# Altium project PCU.PrjPCB (part 2 of 2)

## Sheet pcuOut.SchDoc
size A3
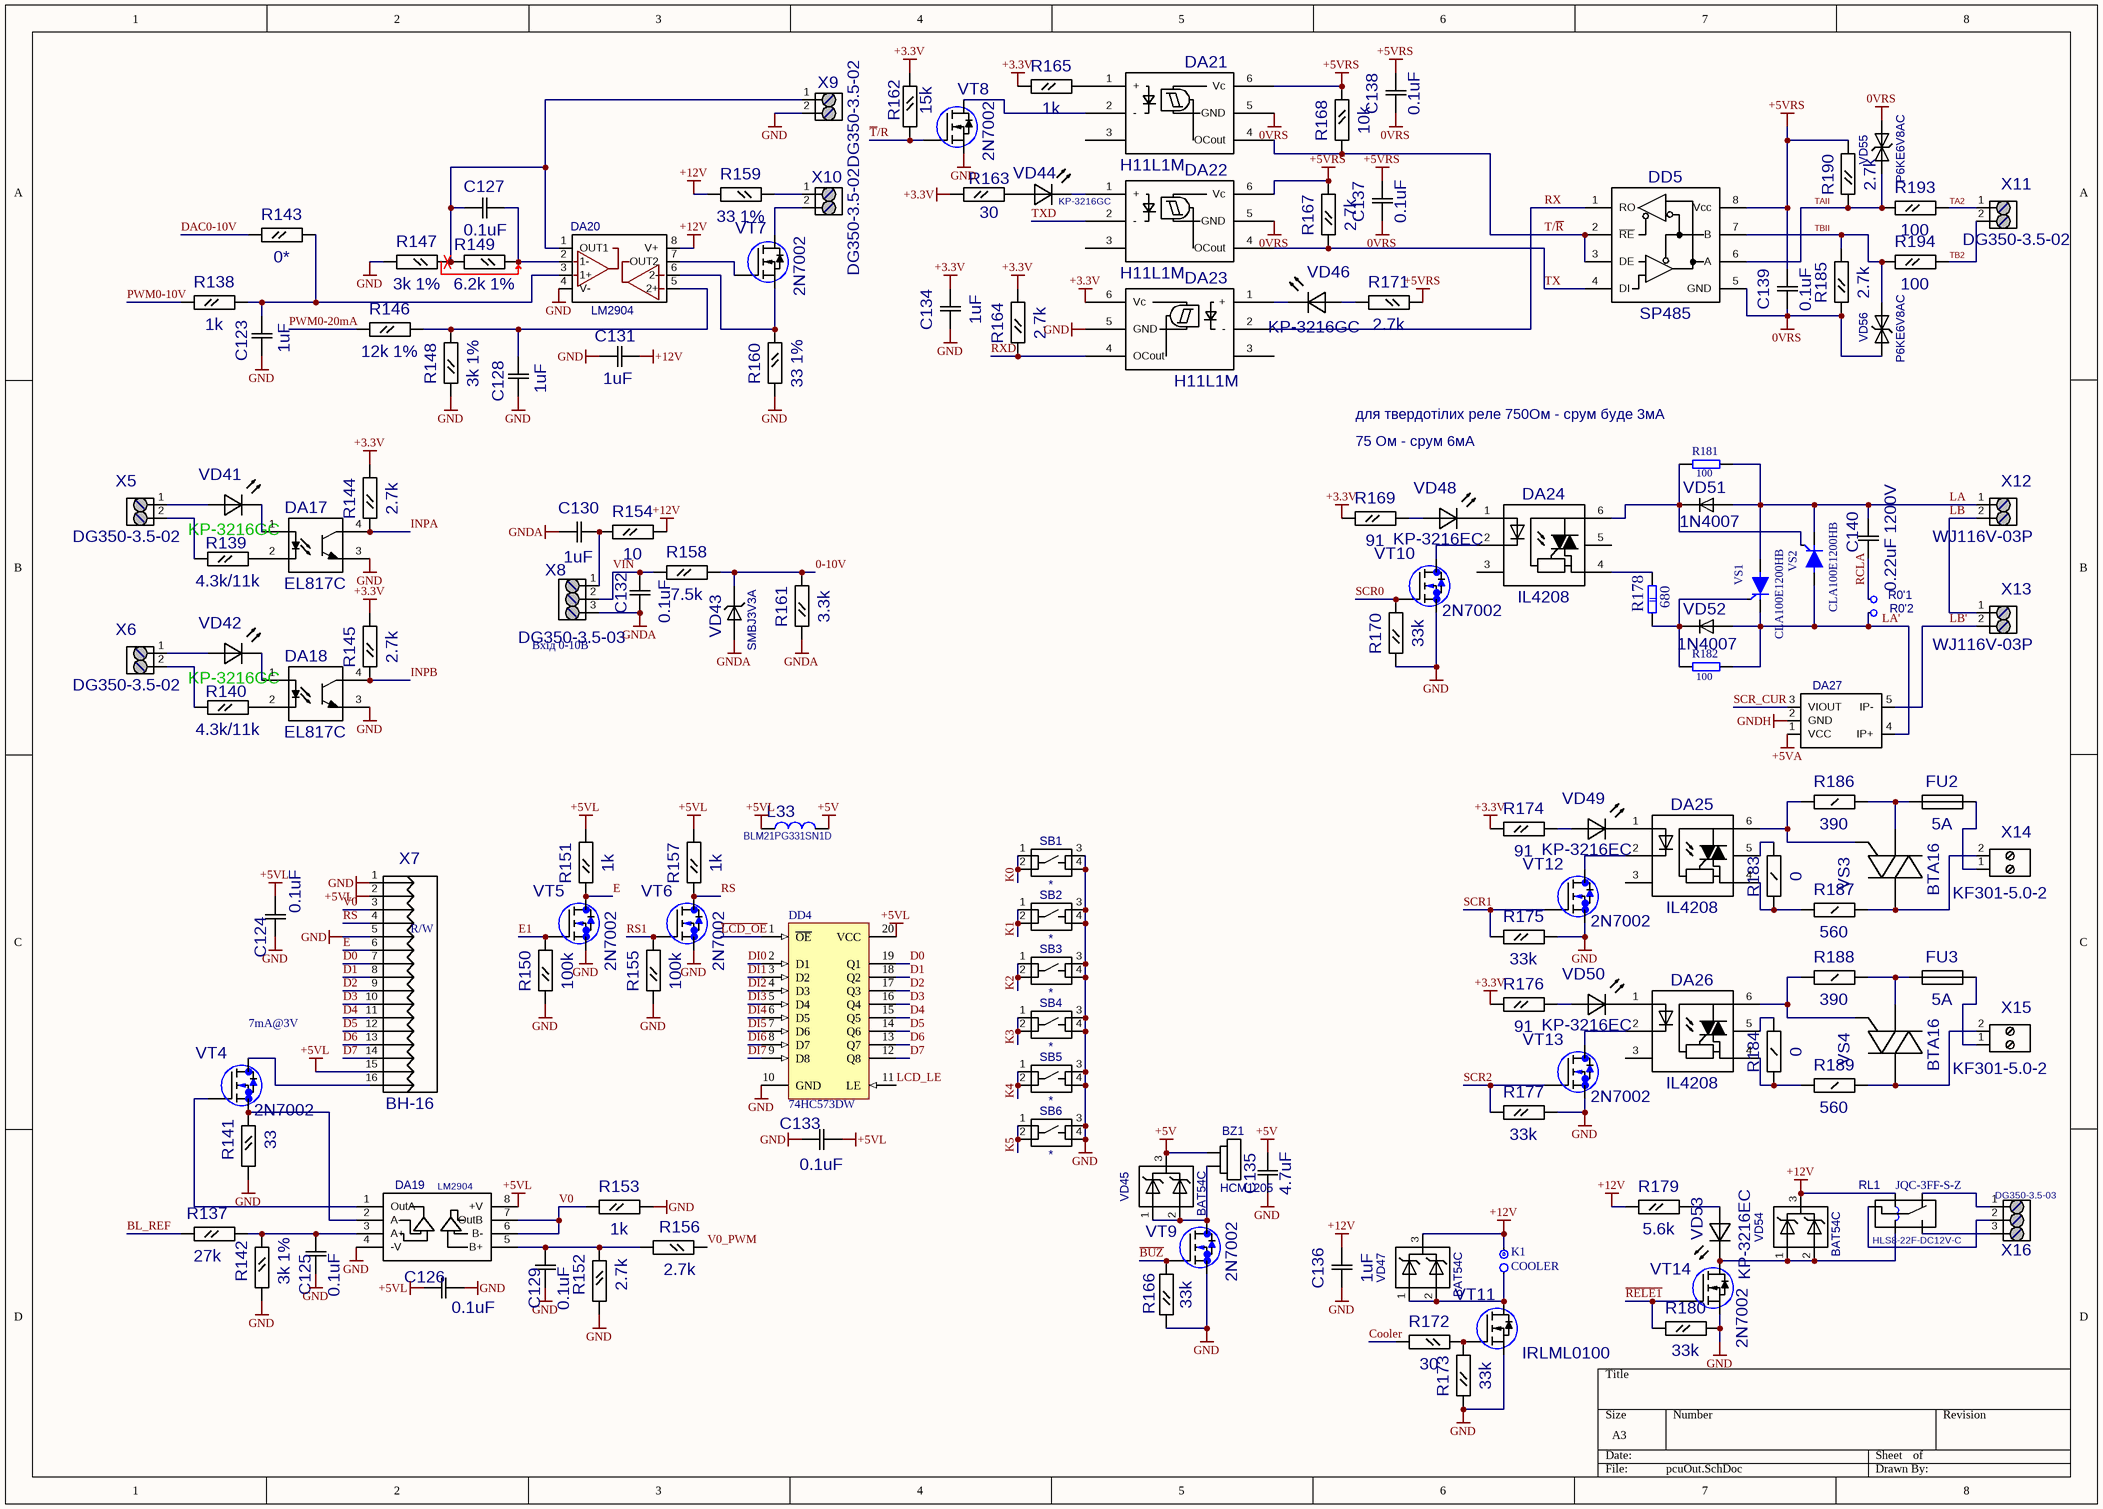
[diagram p4: pcuOut.SchDoc]

### Parts
BZ1  HCM1205  [D12_P7-62]
C123  value 1uF  [C0805]  (hidden comment: C0805)
C124  value 0.1uF  [C0805]  (hidden comment: C0805)
C125  value 0.1uF  [C0805]  (hidden comment: C0805)
C126  value 0.1uF  [C0805]  (hidden comment: C0805)
C127  value 0.1uF  [C0805]  (hidden comment: C0805)
C128  value 1uF  [C0805]  (hidden comment: C0805)
C129  value 0.1uF  [C0805]  (hidden comment: C0805)
C130  value 1uF  [C0805]  (hidden comment: C0805)
C131  value 1uF  [C0805]  (hidden comment: C0805)
C132  value 0.1uF  [C0805]  (hidden comment: C0805)
C133  value 0.1uF  [C0805]  (hidden comment: C0805)
C134  value 1uF  [C0805]  (hidden comment: C0805)
C135  value 4.7uF  [C1206]  (hidden comment: C1206)
C136  value 1uF  [C0805]  (hidden comment: C0805)
C137  value 0.1uF  [C0805]  (hidden comment: C0805)
C138  value 0.1uF  [C0805]  (hidden comment: C0805)
C139  value 0.1uF  [C0805]  (hidden comment: C0805)
C140  0.22uF 1200V  [CBB21]
DA17  EL817C  [DIL4SMD]
DA18  EL817C  [DIL4SMD]
DA19  value LM2904  [SO8-150]  (hidden comment: LM358D)
DA20  LM2904  [SO8-1.27]
DA21  H11L1M  [DIP6_SURFACE]
DA22  H11L1M  [DIP6_SURFACE]
DA23  H11L1M  [DIP6_SURFACE]
DA24  IL4208  [DIP6]
DA25  IL4208  [DIP6]
DA26  IL4208  [DIP6]
DA27  ACS758  [CB]  (value not drawn)
DD4  74HC573DW  [DW020_N]
DD5  SP485  [SO8-150]
FU2  value 5A  [FU_5x20]  (hidden comment: FUSE-D5)
FU3  value 5A  [FU_5x20]  (hidden comment: FUSE-D5)
K1  COOLER  [J1x2]
L33  BLM21PG331SN1D  [R0805]
R0'1  1mm  [PCB_hole_1mm]  (value not drawn)
R0'2  1mm  [PCB_hole_1mm]  (value not drawn)
R137  value 27k  [R0805]  (hidden comment: R0805)
R138  value 1k  [R0805]  (hidden comment: R0805)
R139  value 4.3k/11k  [R0805]  (hidden comment: R0805)
R140  value 4.3k/11k  [R0805]  (hidden comment: R0805)
R141  value 33  [R0805]  (hidden comment: R0805)
R142  value 3k 1%  [R0805]  (hidden comment: R0805)
R143  value 0*  [R0805]  (hidden comment: R0805)
R144  value 2.7k  [R0805]  (hidden comment: R0805)
R145  value 2.7k  [R0805]  (hidden comment: R0805)
R146  value 12k 1%  [R0805]  (hidden comment: R0805)
R147  value 3k 1%  [R0805]  (hidden comment: R0805)
R148  value 3k 1%  [R0805]  (hidden comment: R0805)
R149  value 6.2k 1%  [R0805]  (hidden comment: R0805)
R150  value 100k  [R0805]  (hidden comment: R0805)
R151  value 1k  [R0805]  (hidden comment: R0805)
R152  value 2.7k  [R0805]  (hidden comment: R0805)
R153  value 1k  [R0805]  (hidden comment: R0805)
R154  value 10  [R0805]  (hidden comment: R0805)
R155  value 100k  [R0805]  (hidden comment: R0805)
R156  value 2.7k  [R0805]  (hidden comment: R0805)
R157  value 1k  [R0805]  (hidden comment: R0805)
R158  value 7.5k  [R0805]  (hidden comment: R0805)
R159  value 33 1%  [R0805]  (hidden comment: R0805)
R160  value 33 1%  [R0805]  (hidden comment: R0805)
R161  value 3.3k  [R0805]  (hidden comment: R0805)
R162  value 15k  [R0805]  (hidden comment: R0805)
R163  value 30  [R0805]  (hidden comment: R0805)
R164  value 2.7k  [R0805]  (hidden comment: R0805)
R165  value 1k  [R0805]  (hidden comment: R0805)
R166  value 33k  [R0805]  (hidden comment: R0805)
R167  value 2.7k  [R0805]  (hidden comment: R0805)
R168  value 10k  [R0805]  (hidden comment: R0805)
R169  value 91  [R0805]  (hidden comment: R0805)
R170  value 33k  [R0805]  (hidden comment: R0805)
R171  value 2.7k  [R0805]  (hidden comment: R0805)
R172  value 30  [R0805]  (hidden comment: R0805)
R173  value 33k  [R0805]  (hidden comment: R0805)
R174  value 91  [R0805]  (hidden comment: R0805)
R175  value 33k  [R0805]  (hidden comment: R0805)
R176  value 91  [R0805]  (hidden comment: R0805)
R177  value 33k  [R0805]  (hidden comment: R0805)
R178  680  [R2W CF-700]
R179  value 5.6k  [R0805]  (hidden comment: R0805)
R180  value 33k  [R0805]  (hidden comment: R0805)
R181  100  [R0.5-400]
R182  100  [R0.5-400]
R183  value 0  [R1206]  (hidden comment: R1206)
R184  value 0  [R1206]  (hidden comment: R1206)
R185  value 2.7k  [R0805]  (hidden comment: R0805)
R186  value 390  [R1206]  (hidden comment: R1206)
R187  value 560  [R1206]  (hidden comment: R1206)
R188  value 390  [R1206]  (hidden comment: R1206)
R189  value 560  [R1206]  (hidden comment: R1206)
R190  value 2.7k  [R0805]  (hidden comment: R0805)
R193  value 100  [R0805]  (hidden comment: R0805)
R194  value 100  [R0805]  (hidden comment: R0805)
RL1  value HLS8-22F-DC12V-C  [RELAY833]  (hidden comment: RELEY833)
SB1  *  [DTSM-6]
SB2  *  [DTSM-6]
SB3  *  [DTSM-6]
SB4  *  [DTSM-6]
SB5  *  [DTSM-6]
SB6  *  [DTSM-6]
VD41  KP-3216GC  [KP-3216 Hole]
VD42  KP-3216GC  [KP-3216 Hole]
VD43  value SMBJ3V3A  [DO-214AA(SMB)]  (hidden comment: 10BQ100)
VD44  KP-3216GC  [KP-3216]
VD45  BAT54C  [SOT23-1]
VD46  KP-3216GC  [KP-3216]
VD47  BAT54C  [SOT23-1]
VD48  KP-3216EC  [KP-3216]
VD49  KP-3216EC  [KP-3216]
VD50  KP-3216EC  [KP-3216]
VD51  value 1N4007  [DIOD_Wsmall_bigholes]  (hidden comment: DIOD)
VD52  value 1N4007  [DIOD_Wsmall_bigholes]  (hidden comment: DIOD)
VD53  KP-3216EC  [KP-3216 Hole]
VD54  BAT54C  [SOT23-1]
VD55  value P6KE6V8AC  [DIOD_small_bigholes]  (hidden comment: P6KE___C)
VD56  value P6KE6V8AC  [DIOD_small_bigholes]  (hidden comment: P6KE___C)
VS1  CLA100E1200HB  [TO247-RA-800a]
VS2  CLA100E1200HB  [TO247-RA-800a]
VS3  value BTA16  [TO220-RB-600]  (hidden comment: TRIAC)
VS4  value BTA16  [TO220-RB-600]  (hidden comment: TRIAC)
VT4  2N7002  [SOT23-1]
VT5  2N7002  [SOT23-1]
VT6  2N7002  [SOT23-1]
VT7  2N7002  [SOT23-1]
VT8  2N7002  [SOT23-1]
VT9  2N7002  [SOT23-1]
VT10  2N7002  [SOT23-1]
VT11  IRLML0100  [SOT23-1]
VT12  2N7002  [SOT23-1]
VT13  2N7002  [SOT23-1]
VT14  2N7002  [SOT23-1]
X5  DG350-3.5-02  [DG350-3.5-02 SLIM]
X6  DG350-3.5-02  [DG350-3.5-02 SLIM]
X7  BH-16  [BH-16]
X8  DG350-3.5-03  [DG350-3.5-03]
X9  DG350-3.5-02  [DG350-3.5-02]
X10  DG350-3.5-02  [DG350-3.5-02]
X11  DG350-3.5-02  [DG350-3.5-02 SLIM]
X12  WJ116V-03P  [WJ116V]
X13  WJ116V-03P  [WJ116V]
X14  KF301-5.0-2  [KF301-5.0-2]
X15  KF301-5.0-2  [KF301-5.0-2]
X16  DG350-3.5-03  [DG350-3.5-03 slim]

### Nets
0VRS: C137.1 C138.1 C139.1 DA21.5(GND) DA22.5(GND) DD5.5(GND) R185.2 VD55.2 VD56.2
+3.3V: C134.2 DA23.6(Vc) R144.1 R145.1 R162.2 R163.2 R164.1 R165.2 R169.2 R174.2 R176.2
+5V: BZ1.1 C135.2 L33.2 VD45.3
+5VA: DA27.1(VCC)
+5VL: C124.1 C126.2 C133.1 DA19.8(+V) DD4.20(VCC) L33.1 R151.1 R157.1 X7.2 X7.15
+5VRS: C137.2 C138.2 C139.2 DA21.6(Vc) DA22.6(Vc) DD5.8(Vcc) R167.1 R168.2 R171.2 R190.1
+12V: C131.2 C136.2 DA20.8(V+) K1.1 R154.1 R159.1 R179.2 RL1.5 VD47.3 VD54.3
GND: C123.1 C124.2 C125.1 C126.1 C128.1 C129.1 C131.1 C133.2 C134.1 C135.1 C136.1 DA17.3(E) DA18.3(E) DA19.4(-V) DA20.4(V-) DA23.5(GND) DD4.10(GND) R141.1 R142.1 R147.1 R148.2 R150.2 R152.1 R153.1 R155.2 R160.1 R166.2 R170.2 R173.2 R175.1 R177.1 R180.1 SB1.3 SB1.4 SB2.3 SB2.4 SB3.3 SB3.4 SB4.3 SB4.4 SB5.3 SB5.4 SB6.3 SB6.4 VT5.2(S) VT6.2(S) VT8.2(S) VT9.2(S) VT10.2(S) VT11.2(S) VT12.2(S) VT13.2(S) VT14.2(S) X7.1 X7.5 X9.2
GNDA: C130.1 C132.2 R161.2 VD43.2 X8.3
GNDH: DA27.2(GND)
0-10V: R158.1 R161.1 VD43.1
~{BUZ}: R166.1 VT9.1(G)
~{LCD_OE}: DD4.1(~{OE})
~{RELE1}: R180.2 VT14.1(G)
BL_REF: R137.2
Cooler: R172.1
D0: DD4.19(Q1) X7.7
D1: DD4.18(Q2) X7.8
D2: DD4.17(Q3) X7.9
D3: DD4.16(Q4) X7.10
D4: DD4.15(Q5) X7.11
D5: DD4.14(Q6) X7.12
D6: DD4.13(Q7) X7.13
D7: DD4.12(Q8) X7.14
DAC0-10V: R143.2
DI0: DD4.2(D1)
DI1: DD4.3(D2)
DI2: DD4.4(D3)
DI3: DD4.5(D4)
DI4: DD4.6(D5)
DI5: DD4.7(D6)
DI6: DD4.8(D7)
DI7: DD4.9(D8)
E: R151.2 VT5.3(D) X7.6
E1: R150.1 VT5.1(G)
INPA: DA17.4(C) R144.2
INPB: DA18.4(C) R145.2
K0: SB1.1 SB1.2
K1: SB2.1 SB2.2
K2: SB3.1 SB3.2
K3: SB4.1 SB4.2
K4: SB5.1 SB5.2
K5: SB6.1 SB6.2
LA: C140.2 R181.2 VD51.2(+) VS1.2(A) VS2.1(C) X12.1
LA': DA27.4(IP+) R0'2.?1 R182.2 VD52.2(+) VS1.1(C) VS2.2(A)
LB: X12.2 X13.1
LB': DA27.5(IP-) X13.2
LCD_LE: DD4.11(LE)
PWM0-10V: R138.2
PWM0-20mA: R146.2
RCLA: C140.1 R0'1.?1
RS: R157.2 VT6.3(D) X7.4
RS1: R155.1 VT6.1(G)
RX: DA23.2(-) DD5.1(RO)
RXD: DA23.4(OCout) R164.2
SCR0: R170.1 VT10.1(G)
SCR1: R175.2 VT12.1(G)
SCR2: R177.2 VT13.1(G)
SCR_CUR: DA27.3(VIOUT)
T/~{R}: DA21.4(OCout) DD5.2(~{RE}) DD5.3(DE) R168.1
~{T}/R: R162.1 VT8.1(G)
TA2: R193.1 X11.1
TAII: DD5.6(A) R190.2 R193.2 VD55.1
TB2: R194.1 X11.2
TBII: DD5.7(B) R185.1 R194.2 VD56.1
TX: DA22.4(OCout) DD5.4(DI) R167.2
TXD: DA22.2(-)
V0: DA19.6(B-) DA19.7(OutB) R153.2 X7.3
V0_PWM: R156.2
VIN: C132.1 R158.2 X8.2
NetBZ1_2: BZ1.2 VD45.1 VD45.2 VT9.3(D)
NetC123_2: C123.2 DA20.3(1+) R138.1 R143.1
NetC125_2: C125.2 DA19.3(A+) R137.1 R142.2
NetC127_1: C127.1 DA20.1(OUT1) R147.2 R149.1 X9.1
NetC127_2: C127.2 DA20.2(1-) R149.2
NetC128_2: C128.2 DA20.5(2+) R146.1 R148.1
NetC129_2: C129.2 DA19.5(B+) R152.2 R156.1
NetC130_2: C130.2 R154.2 X8.1
NetDA17_1: DA17.1(+) VD41.2
NetDA17_2: DA17.2(-) R139.1
NetDA18_1: DA18.1(+) VD42.2
NetDA18_2: DA18.2(-) R140.1
NetDA19_1: DA19.1(OutA) VT4.1(G)
NetDA19_2: DA19.2(A-) R141.2 VT4.2(S)
NetDA20_6: DA20.6(2-) R160.2 VT7.2(S)
NetDA20_7: DA20.7(OUT2) VT7.1(G)
NetDA21_1: DA21.1(+) R165.1
NetDA21_2: DA21.2(-) VT8.3(D)
NetDA22_1: DA22.1(+) VD44.2
NetDA23_1: DA23.1(+) VD46.2
NetDA24_1: DA24.1 VD48.2
NetDA24_2: DA24.2 VT10.3(D)
NetDA24_4: DA24.4 R178.2
NetDA24_6: DA24.6 R181.1 VD51.1(-) VS2.3(G)
NetDA25_1: DA25.1 VD49.2
NetDA25_2: DA25.2 VT12.3(D)
NetDA25_4: DA25.4 R183.2 R187.2
NetDA25_5: DA25.5 R183.1
NetDA25_6: DA25.6 R186.2 VS3.3(G)
NetDA26_1: DA26.1 VD50.2
NetDA26_2: DA26.2 VT13.3(D)
NetDA26_4: DA26.4 R184.2 R189.2
NetDA26_5: DA26.5 R184.1
NetDA26_6: DA26.6 R188.2 VS4.3(G)
NetFU2_1: FU2.1 R186.1 VS3.1(A1)
NetFU2_2: FU2.2 X14.1
NetFU3_1: FU3.1 R188.1 VS4.1(A1)
NetFU3_2: FU3.2 X15.1
NetK1_2: K1.2 VD47.1 VD47.2 VT11.3(D)
NetR139_2: R139.2 X5.2
NetR140_2: R140.2 X6.2
NetR159_2: R159.2 X10.1
NetR163_1: R163.1 VD44.1
NetR169_1: R169.1 VD48.1
NetR171_1: R171.1 VD46.1
NetR172_2: R172.2 R173.1 VT11.1(G)
NetR174_1: R174.1 VD49.1
NetR176_1: R176.1 VD50.1
NetR178_1: R178.1 R182.1 VD52.1(-) VS1.3(G)
NetR179_1: R179.1 VD53.1
NetR187_1: R187.1 VS3.2(A2) X14.2
NetR189_1: R189.1 VS4.2(A2) X15.2
NetRL1_1: RL1.1 X16.2
NetRL1_2: RL1.2 X16.3
NetRL1_3: RL1.3 X16.1
NetRL1_4: RL1.4 VD53.2 VD54.1 VD54.2 VT14.3(D)
NetVD41_1: VD41.1 X5.1
NetVD42_1: VD42.1 X6.1
NetVT4_3: VT4.3(D) X7.16
NetVT7_3: VT7.3(D) X10.2

Not connected (* = marked no-connect by the designer): DA21 3; DA22 3; DA23 3; DA24 3 5; DA25 3; DA26 3

### Notes on the sheet
- 75 Ом - срум 6мА
- (near R181) для твердотілих реле 750Ом - срум буде 3мА
- (near X8) Вхід 0-10В
- (near X7) R/W
- (near VT4) 7mA@3V
- (near RL1) JQC-3FF-S-Z

### Library data of the parts
C123-C134 C136-C139 = C0805: RefDes2: {RefDes2}
C135 = C1206: RefDes2: {RefDes2}
C140 = Cap: CBB21; RefDes2: {RefDes2}
DA17 DA18 = PC817: optocuple; Value: EL817C
DA20 = LM2904: LM2903; Value: *
DA21-DA23 = H11L1M: RefDes2: {RefDes2}
DA24-DA26 = IL410: RefDes2: {RefDes2}; Value: IL4208
DD4 = 74HC573DW: Octal D-Type Transparent Latch with 3-State Outputs; Published: 8-Jun-2000; LatestRevisionDate: 13-Apr-2006; LatestRevisionNote: IPC-7351 Footprint Added.; DatasheetVersion: Jun-1989; PackageVersion: Mar-2000; PackageReference: DW020; Publisher: Altium Limited; PackageDescription: 20-Pin Plastic Small Outline Integrated Circuit 1.27 mm Pitch; Code_JEDEC: MS-013; Code_IPC: SOIC127P1030-20; ComponentLink1Description: Manufacturer Link; ComponentLink1URL: http://www.ti.com/
DD5 = SP485: RS485; RefDes2: {RefDes2}; Value: SP485
FU2 FU3 = FUSE-D5: Fuse
K1 = H-1x2
L33 = BLM21PG331SN1D: Ferrite beads; Value: BLM21PG331SN1D
R0'1 R0'2 = PCB_1H: PCB_1R
R137-R177 R179 R180 R185 R190 R193 R194 = R0805: RefDes2: {RefDes2}
R178 = R-2W CF: 2W 5% 500V; Price: 0.1; Value: 680
R181 R182 = R-0.5W: 0.5W 5% 350V; Value: 100; Price: 0.01
R183 R184 R186-R189 = R1206: RefDes2: {RefDes2}
SB1-SB6 = TACT: Value: *
VD41 VD42 VD44 VD46 VD48-VD50 VD53 = KP-3216EC: RefDes2: {RefDes2}
  VD44 VD46: Value: KP-3216GC
VD43 = 10BQ100: RefDes2: {RefDes2}
VD51 VD52 = DIOD: RefDes2: {RefDes2}
VD55 VD56 = P6KE___C: RefDes2: {RefDes2}
VS1 VS2 = Tirystor: Value: *
VT11 = 2N7002: Value: IRLML0100
X5 X6 X9-X11 = DG350-3.5-02: RefDes2: {RefDes2}
X7 = BH-16: RefDes2: {RefDes2}
X8 X16 = DG350-3.5-03: 3.5mm 3pins; Value: DG350-3.5-03
X12 X13 = WJ116V-03P: RefDes2: {RefDes2}
X14 X15 = KF301-5.0-2: 5mm 2pins; RefDes2: {RefDes2}
BZ1 = HCM1205: Value: *
DA27 = ACS758: Value: *

## Sheet pcuPL.SchDoc
size A4
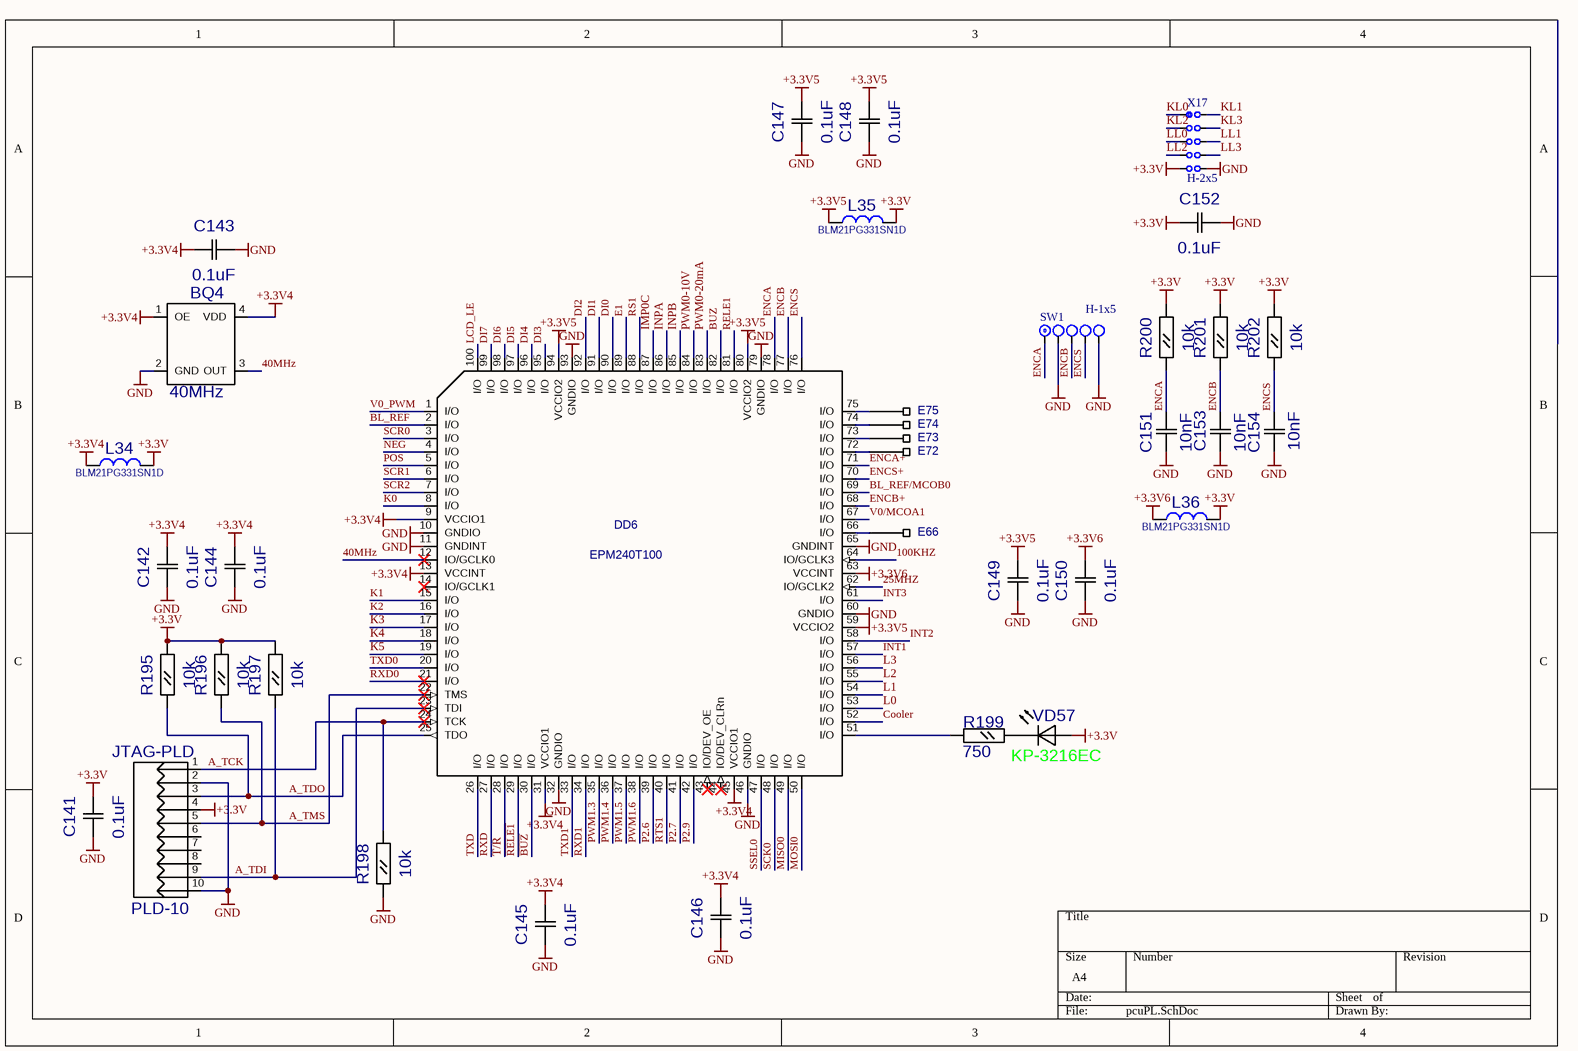
[diagram p5: pcuPL.SchDoc]

### Parts
BQ4  40MHz  [3225]
C141  value 0.1uF  [C0805]  (hidden comment: C0805)
C142  value 0.1uF  [C0805]  (hidden comment: C0805)
C143  value 0.1uF  [C0805]  (hidden comment: C0805)
C144  value 0.1uF  [C0805]  (hidden comment: C0805)
C145  value 0.1uF  [C0805]  (hidden comment: C0805)
C146  value 0.1uF  [C0805]  (hidden comment: C0805)
C147  value 0.1uF  [C0805]  (hidden comment: C0805)
C148  value 0.1uF  [C0805]  (hidden comment: C0805)
C149  value 0.1uF  [C0805]  (hidden comment: C0805)
C150  value 0.1uF  [C0805]  (hidden comment: C0805)
C151  value 10nF  [C0805]  (hidden comment: C0805)
C152  value 0.1uF  [C0805]  (hidden comment: C0805)
C153  value 10nF  [C0805]  (hidden comment: C0805)
C154  value 10nF  [C0805]  (hidden comment: C0805)
DD6  EPM240T100  [QFP100-0.5MM]
E66  PCB_1R  [PCB_1R_Oval]  (value not drawn)
E72  PCB_1R  [PCB_1R_Oval]  (value not drawn)
E73  PCB_1R  [PCB_1R_Oval]  (value not drawn)
E74  PCB_1R  [PCB_1R_Oval]  (value not drawn)
E75  PCB_1R  [PCB_1R_Oval]  (value not drawn)
JTAG-PLD  PLD-10  [HR-2x5L]
L34  BLM21PG331SN1D  [R0805]
L35  BLM21PG331SN1D  [R0805]
L36  BLM21PG331SN1D  [R0805]
R195  value 10k  [R0805]  (hidden comment: R0805)
R196  value 10k  [R0805]  (hidden comment: R0805)
R197  value 10k  [R0805]  (hidden comment: R0805)
R198  value 10k  [R0805]  (hidden comment: R0805)
R199  value 750  [R0805]  (hidden comment: R0805)
R200  value 10k  [R0805]  (hidden comment: R0805)
R201  value 10k  [R0805]  (hidden comment: R0805)
R202  value 10k  [R0805]  (hidden comment: R0805)
SW1  H-1x5  [J1x5]
VD57  KP-3216EC  [KP-3216]
X17  H-2x5  [J2x5]

### Nets
+3.3V: C141.2 C152.2 JTAG-PLD.4 L34.2 L35.2 L36.2 R195.1 R196.1 R197.1 R200.1 R201.1 R202.1 VD57.1 X17.9
+3.3V4: BQ4.1(OE) BQ4.4(VDD) C142.2 C143.2 C144.2 C145.2 C146.2 DD6.9(VCCIO1) DD6.13(VCCINT) DD6.31(VCCIO1) DD6.45(VCCIO1) L34.1
+3.3V5: C147.2 C148.2 C149.2 DD6.59(VCCIO2) DD6.80(VCCIO2) DD6.94(VCCIO2) L35.1
+3.3V6: C150.2 DD6.63(VCCINT) L36.1
GND: BQ4.2(GND) C141.1 C142.1 C143.1 C144.1 C145.1 C146.1 C147.1 C148.1 C149.1 C150.1 C151.1 C152.1 C153.1 C154.1 DD6.10(GNDIO) DD6.11(GNDINT) DD6.32(GNDIO) DD6.46(GNDIO) DD6.60(GNDIO) DD6.65(GNDINT) DD6.79(GNDIO) DD6.93(GNDIO) JTAG-PLD.2 JTAG-PLD.10 R198.2 SW1.2 SW1.5 X17.10
25MHZ: DD6.62(IO/GCLK2)
40MHz: BQ4.3(OUT) DD6.12(IO/GCLK0)
100KHZ: DD6.64(IO/GCLK3)
~{BUZ}: DD6.30(I/O)
~{RELE1}: DD6.29(I/O)
A_TCK: DD6.24(TCK) JTAG-PLD.1 R198.1
A_TDI: DD6.23(TDI) JTAG-PLD.9 R197.2
A_TDO: DD6.25(TDO) JTAG-PLD.3 R195.2
A_TMS: DD6.22(TMS) JTAG-PLD.5 R196.2
BL_REF: DD6.2(I/O)
BL_REF/MCOB0: DD6.69(I/O)
BUZ: DD6.82(I/O)
Cooler: DD6.52(I/O)
DI0: DD6.90(I/O)
DI1: DD6.91(I/O)
DI2: DD6.92(I/O)
DI3: DD6.95(I/O)
DI4: DD6.96(I/O)
DI5: DD6.97(I/O)
DI6: DD6.98(I/O)
DI7: DD6.99(I/O)
E1: DD6.89(I/O)
ENCA: C151.2 DD6.78(I/O) R200.2 SW1.1
ENCA+: DD6.71(I/O)
ENCB: C153.2 DD6.77(I/O) R201.2 SW1.3
ENCB+: DD6.68(I/O)
ENCS: C154.2 DD6.76(I/O) R202.2 SW1.4
ENCS+: DD6.70(I/O)
IMP0C: DD6.87(I/O)
INPA: DD6.86(I/O)
INPB: DD6.85(I/O)
INT1: DD6.57(I/O)
INT2: DD6.58(I/O)
INT3: DD6.61(I/O)
K0: DD6.8(I/O)
K1: DD6.15(I/O)
K2: DD6.16(I/O)
K3: DD6.17(I/O)
K4: DD6.18(I/O)
K5: DD6.19(I/O)
KL0: X17.1
KL1: X17.2
KL2: X17.3
KL3: X17.4
L0: DD6.53(I/O)
L1: DD6.54(I/O)
L2: DD6.55(I/O)
L3: DD6.56(I/O)
LCD_LE: DD6.100(I/O)
LL0: X17.5
LL1: X17.6
LL2: X17.7
LL3: X17.8
MISO0: DD6.49(I/O)
MOSI0: DD6.50(I/O)
NEG: DD6.4(I/O)
P2.6: DD6.39(I/O)
P2.7: DD6.41(I/O)
P2.9: DD6.42(I/O)
POS: DD6.5(I/O)
PWM0-10V: DD6.84(I/O)
PWM0-20mA: DD6.83(I/O)
PWM1.3: DD6.35(I/O)
PWM1.4: DD6.36(I/O)
PWM1.5: DD6.37(I/O)
PWM1.6: DD6.38(I/O)
RELE1: DD6.81(I/O)
RS1: DD6.88(I/O)
RTS1: DD6.40(I/O)
RXD: DD6.27(I/O)
RXD0: DD6.21(I/O)
RXD1: DD6.34(I/O)
SCK0: DD6.48(I/O)
SCR0: DD6.3(I/O)
SCR1: DD6.6(I/O)
SCR2: DD6.7(I/O)
SSEL0: DD6.47(I/O)
~{T}/R: DD6.28(I/O)
TXD: DD6.26(I/O)
TXD0: DD6.20(I/O)
TXD1: DD6.33(I/O)
V0/MCOA1: DD6.67(I/O)
V0_PWM: DD6.1(I/O)
NetDD6_51: DD6.51(I/O) R199.1
NetDD6_66: DD6.66(I/O) E66.1
NetDD6_72: DD6.72(I/O) E72.1
NetDD6_73: DD6.73(I/O) E73.1
NetDD6_74: DD6.74(I/O) E74.1
NetDD6_75: DD6.75(I/O) E75.1
NetR199_2: R199.2 VD57.2

Not connected (* = marked no-connect by the designer): DD6 14(IO/GCLK1)* 43(IO/DEV_OE)* 44(IO/DEV_CLRn)*; JTAG-PLD 6 7 8

### Library data of the parts
BQ4 = OSC: Value: 40MHz
C141-C154 = C0805: RefDes2: {RefDes2}
JTAG-PLD = PLD-10: Value: jtag; RefDes2: {RefDes2}
L34-L36 = BLM21PG331SN1D: Ferrite beads; Value: BLM21PG331SN1D
R195-R202 = R0805: RefDes2: {RefDes2}
VD57 = KP-3216EC: RefDes2: {RefDes2}
SW1 = H-1x5: Price: 0.05
X17 = H-2x5: Price: 0.010

## Sheet pcuETH.SchDoc
size A3
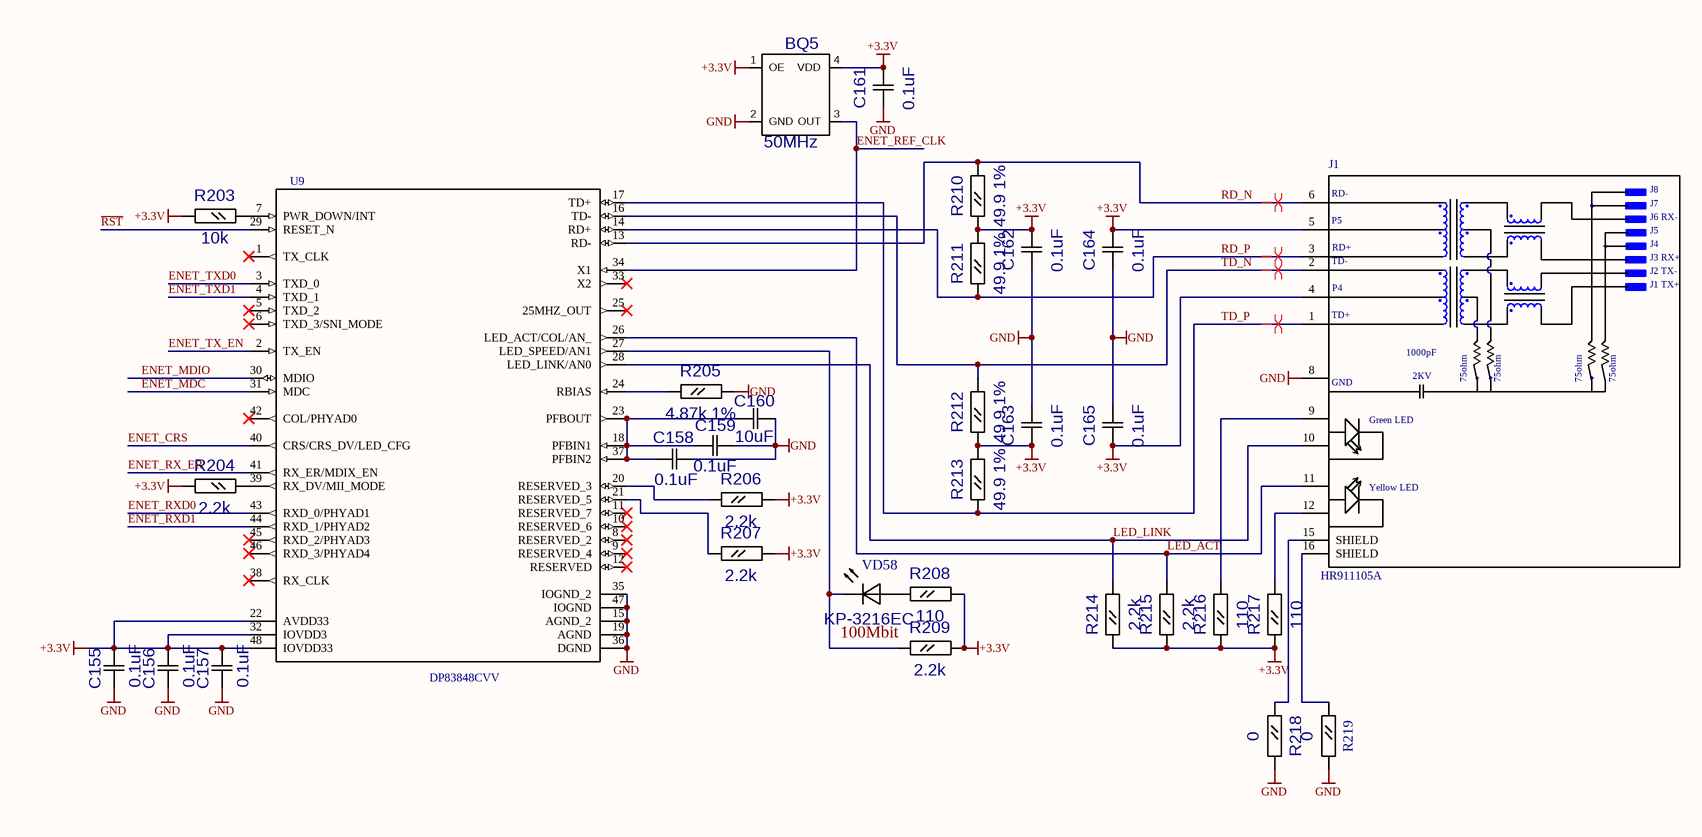
[diagram p6: pcuETH.SchDoc]

### Parts
BQ5  50MHz  [5032]
C155  value 0.1uF  [C0805]  (hidden comment: C0805)
C156  value 0.1uF  [C0805]  (hidden comment: C0805)
C157  value 0.1uF  [C0805]  (hidden comment: C0805)
C158  value 0.1uF  [C0805]  (hidden comment: C0805)
C159  value 0.1uF  [C0805]  (hidden comment: C0805)
C160  value 10uF  [C1206]  (hidden comment: C1206)
C161  value 0.1uF  [C0805]  (hidden comment: C0805)
C162  value 0.1uF  [C0805]  (hidden comment: C0805)
C163  value 0.1uF  [C0805]  (hidden comment: C0805)
C164  value 0.1uF  [C0805]  (hidden comment: C0805)
C165  value 0.1uF  [C0805]  (hidden comment: C0805)
J1  HR911105A  [HANRUN_HR911105A]
R203  value 10k  [R0805]  (hidden comment: R0805)
R204  value 2.2k  [R0805]  (hidden comment: R0805)
R205  value 4.87k 1%  [R0805]  (hidden comment: R0805)
R206  value 2.2k  [R0805]  (hidden comment: R0805)
R207  value 2.2k  [R0805]  (hidden comment: R0805)
R208  value 110  [R0805]  (hidden comment: R0805)
R209  value 2.2k  [R0805]  (hidden comment: R0805)
R210  value 49.9 1%  [R0805]  (hidden comment: R0805)
R211  value 49.9 1%  [R0805]  (hidden comment: R0805)
R212  value 49.9 1%  [R0805]  (hidden comment: R0805)
R213  value 49.9 1%  [R0805]  (hidden comment: R0805)
R214  value 2.2k  [R0805]  (hidden comment: R0805)
R215  value 2.2k  [R0805]  (hidden comment: R0805)
R216  value 110  [R0805]  (hidden comment: R0805)
R217  value 110  [R0805]  (hidden comment: R0805)
R218  value 0  [R0805]  (hidden comment: R0805)
R219  value 0  [R0805]  (hidden comment: R0805)
U9  DP83848CVV  [QFP48]
VD58  KP-3216EC  [KP-3216 Hole]

### Nets
+3.3V: BQ5.1(OE) BQ5.4(VDD) C155.2 C156.2 C157.2 C161.2 C162.2 C163.1 C164.2 C165.1 J1.4(P4) J1.5(P5) R203.1 R204.1 R206.1 R207.1 R208.1 R209.1 R210.2 R211.1 R212.2 R213.1 R214.2 R215.2 R216.2 R217.2 U9.22(AVDD33) U9.32(IOVDD3) U9.48(IOVDD33)
GND: BQ5.2(GND) C155.1 C156.1 C157.1 C158.2 C159.2 C160.2 C161.1 C162.1 C163.2 C164.1 C165.2 J1.8(GND) R205.1 R218.1 R219.1 U9.15(AGND_2) U9.19(AGND) U9.35(IOGND_2) U9.36(DGND) U9.47(IOGND)
ENET_CRS: U9.40(CRS/CRS_DV/LED_CFG)
ENET_MDC: U9.31(MDC)
ENET_MDIO: U9.30(MDIO)
ENET_REF_CLK: BQ5.3(OUT) U9.34(X1)
ENET_RX_ER: U9.41(RX_ER/MDIX_EN)
ENET_RXD0: U9.43(RXD_0/PHYAD1)
ENET_RXD1: U9.44(RXD_1/PHYAD2)
ENET_TX_EN: U9.2(TX_EN)
ENET_TXD0: U9.3(TXD_0)
ENET_TXD1: U9.4(TXD_1)
LED_ACT: J1.11(YA) R215.1 U9.26(LED_ACT/COL/AN_)
LED_LINK: J1.10(GC) R214.1 U9.28(LED_LINK/AN0)
~{RST}: U9.29(RESET_N)
RD_N: J1.6(RD-) R210.1 U9.13(RD-)
RD_P: J1.3(RD+) R211.2 U9.14(RD+)
TD_N: J1.2(TD-) R212.1 U9.16(TD-)
TD_P: J1.1(TD+) R213.2 U9.17(TD+)
NetC158_1: C158.1 C159.1 C160.1 U9.18(PFBIN1) U9.23(PFBOUT) U9.37(PFBIN2)
NetJ1_9: J1.9(GA) R216.1
NetJ1_12: J1.12(YC) R217.1
NetJ1_15: J1.15(SHIELD) R218.2
NetJ1_16: J1.16(SHIELD) R219.2
NetR203_2: R203.2 U9.7(PWR_DOWN/INT)
NetR204_2: R204.2 U9.39(RX_DV/MII_MODE)
NetR205_2: R205.2 U9.24(RBIAS)
NetR206_2: R206.2 U9.20(RESERVED_3)
NetR207_2: R207.2 U9.21(RESERVED_5)
NetR208_2: R208.2 VD58.1
NetR209_2: R209.2 U9.27(LED_SPEED/AN1) VD58.2

Not connected (* = marked no-connect by the designer): U9 1(TX_CLK)* 5(TXD_2)* 6(TXD_3/SNI_MODE)* 8(RESERVED_2)* 9(RESERVED_4)* 10(RESERVED_6)* 11(RESERVED_7)* 12(RESERVED)* 25(25MHZ_OUT)* 33(X2)* 38(RX_CLK)* 42(COL/PHYAD0)* 45(RXD_2/PHYAD3)* 46(RXD_3/PHYAD4)*

### Layout directives
differential pair: RD_N, RD_P, TD_N, TD_P

### Notes on the sheet
- (near R209) 100Mbit
- (in symbol HR911105A) J8; J7; J6 RX-; J5; J4; J3 RX+; J2 TX-; J1 TX+; 1000pF; 2KV; 75ohm; Green LED; Yellow LED

### Library data of the parts
BQ5 = OSC: Value: 50MHz
C155-C159 C161-C165 = C0805: RefDes2: {RefDes2}
C160 = C1206: RefDes2: {RefDes2}
J1 = HR911105A: DIP RJ45 Connector;; MF: HanRun; Availability: Unavailable; MP: HR911105A; Price: None; Package: None; Value: *
R203-R219 = R0805: RefDes2: {RefDes2}
U9 = DP83848CVV: PHYTER Commercial Temperature Single Port 10/100 Mb/s Ethernet Physical Layer Transceiver 48-LQFP 0 to 70; MF: Texas Instruments; MP: DP83848CVV/NOPB; Digi-Key_Part_Number: DP83848CVV/NOPB-ND; Digi-Key_Purchase_URL: https://www.digikey.com/product-detail/en/texas-instruments/DP83848CVV-NOPB/DP83848CVV-NOPB-ND/947542?WT.z_cid=ref_snapeda&utm_source=snapeda&utm_medium=aggregator&utm_campaign=buynow; Package: LQFP-48 Texas Instruments; Value: *
VD58 = KP-3216EC: RefDes2: {RefDes2}

## Nets that join several sheets
0VRS: pcuPWR (15 pins), pcuOut (9 pins)
+3.3V: pcuAI (R57.2 R58.2), pcuTC (5 pins), pcuCPU (13 pins), pcuPWR (6 pins), pcuOut (11 pins), pcuPL (14 pins), pcuETH (29 pins)
+3.3VF: pcuTC (12 pins), pcuPWR (L32.2 R131.1 R135.2)
+5V: pcuPWR (6 pins), pcuOut (BZ1.1 C135.2 L33.2 VD45.3)
+5VA: pcuAI (36 pins), pcuPWR (C93.1 C95.2 L26.2), pcuOut (DA27.1)
+5VRS: pcuPWR (5 pins), pcuOut (10 pins)
+12V: pcuPWR (16 pins), pcuOut (10 pins)
-5VA: pcuAI (21 pins), pcuPWR (C94.2 C96.1 L27.2)
GND: pcuAI (VT1.2 VT2.2), pcuTC (C42.1 DA7.5 DA8.3), pcuCPU (11 pins), pcuPWR (28 pins), pcuOut (56 pins), pcuPL (29 pins), pcuETH (21 pins)
GNDA: pcuAI (WA1.1), pcuCPU (11 pins), pcuOut (5 pins)
GNDF: pcuTC (10 pins), pcuPWR (16 pins)
GNDH: pcuAI (43 pins), pcuPWR (13 pins), pcuOut (DA27.2)
0-10V: pcuCPU (DD2.20), pcuOut (R158.1 R161.1 VD43.1)
25MHZ: pcuCPU (DD2.49), pcuPL (DD6.62)
100KHZ: pcuCPU (DD2.48), pcuPL (DD6.64)
~{BUZ}: pcuOut (R166.1 VT9.1), pcuPL (DD6.30)
~{LCD_OE}: pcuCPU (DD2.26), pcuOut (DD4.1)
~{RELE1}: pcuOut (R180.2 VT14.1), pcuPL (DD6.29)
BL_REF: pcuOut (R137.2), pcuPL (DD6.2)
BL_REF/MCOB0: pcuCPU (DD2.36), pcuPL (DD6.69)
BUZ: pcuCPU (DD2.27), pcuPL (DD6.82)
Cooler: pcuOut (R172.1), pcuPL (DD6.52)
DAC0-10V: pcuCPU (DD2.6), pcuOut (R143.2)
DI0: pcuOut (DD4.2), pcuPL (DD6.90)
DI1: pcuOut (DD4.3), pcuPL (DD6.91)
DI2: pcuOut (DD4.4), pcuPL (DD6.92)
DI3: pcuOut (DD4.5), pcuPL (DD6.95)
DI4: pcuOut (DD4.6), pcuPL (DD6.96)
DI5: pcuOut (DD4.7), pcuPL (DD6.97)
DI6: pcuOut (DD4.8), pcuPL (DD6.98)
DI7: pcuOut (DD4.9), pcuPL (DD6.99)
E1: pcuOut (R150.1 VT5.1), pcuPL (DD6.89)
ENCA+: pcuCPU (DD2.34), pcuPL (DD6.71)
ENCB+: pcuCPU (DD2.37), pcuPL (DD6.68)
ENCS+: pcuCPU (DD2.35), pcuPL (DD6.70)
ENET_CRS: pcuCPU (DD2.92), pcuETH (U9.40)
ENET_MDC: pcuCPU (DD2.87), pcuETH (U9.31)
ENET_MDIO: pcuCPU (DD2.86), pcuETH (U9.30)
ENET_REF_CLK: pcuCPU (DD2.88), pcuETH (BQ5.3 U9.34)
ENET_RX_ER: pcuCPU (DD2.89), pcuETH (U9.41)
ENET_RXD0: pcuCPU (DD2.91), pcuETH (U9.43)
ENET_RXD1: pcuCPU (DD2.90), pcuETH (U9.44)
ENET_TX_EN: pcuCPU (DD2.93), pcuETH (U9.2)
ENET_TXD0: pcuCPU (DD2.95), pcuETH (U9.3)
ENET_TXD1: pcuCPU (DD2.94), pcuETH (U9.4)
I_SCR: pcuAI (DA4.7 R54.1 VD9.1), pcuCPU (DD2.8)
IMP0C: pcuTC (DA8.4 R85.2), pcuPL (DD6.87)
INPA: pcuOut (DA17.4 R144.2), pcuPL (DD6.86)
INPB: pcuOut (DA18.4 R145.2), pcuPL (DD6.85)
INT1: pcuCPU (DD2.52), pcuPL (DD6.57)
INT2: pcuCPU (DD2.51), pcuPL (DD6.58)
INT3: pcuCPU (DD2.50), pcuPL (DD6.61)
K0: pcuOut (SB1.1 SB1.2), pcuPL (DD6.8)
K1: pcuOut (SB2.1 SB2.2), pcuPL (DD6.15)
K2: pcuOut (SB3.1 SB3.2), pcuPL (DD6.16)
K3: pcuOut (SB4.1 SB4.2), pcuPL (DD6.17)
K4: pcuOut (SB5.1 SB5.2), pcuPL (DD6.18)
K5: pcuOut (SB6.1 SB6.2), pcuPL (DD6.19)
KL0: pcuCPU (DD2.40), pcuPL (X17.1)
KL1: pcuCPU (DD2.43), pcuPL (X17.2)
KL2: pcuCPU (DD2.44), pcuPL (X17.3)
KL3: pcuCPU (DD2.45), pcuPL (X17.4)
L0: pcuCPU (DD2.59), pcuPL (DD6.53)
L1: pcuCPU (DD2.58), pcuPL (DD6.54)
L2: pcuCPU (DD2.57), pcuPL (DD6.55)
L3: pcuCPU (DD2.56), pcuPL (DD6.56)
LA: pcuAI (R1.2), pcuOut (6 pins)
LA': pcuAI (DA1.1 DA1.2), pcuOut (6 pins)
LB: pcuAI (R2.2 R3.2), pcuOut (X12.2 X13.1)
LB': pcuAI (DA1.3 DA1.4 R4.2), pcuOut (DA27.5 X13.2)
LCD_LE: pcuOut (DD4.11), pcuPL (DD6.100)
LL0: pcuCPU (DD2.38), pcuPL (X17.5)
LL1: pcuCPU (DD2.33), pcuPL (X17.6)
LL2: pcuCPU (DD2.32), pcuPL (X17.7)
LL3: pcuCPU (DD2.30), pcuPL (X17.8)
MISO0: pcuCPU (DD2.61), pcuPL (DD6.49)
MOSI0: pcuCPU (DD2.60), pcuPL (DD6.50)
NEG: pcuAI (R58.1 VT2.3), pcuPL (DD6.4)
P2.6: pcuCPU (DD2.67), pcuPL (DD6.39)
P2.7: pcuCPU (DD2.65), pcuPL (DD6.41)
P2.9: pcuCPU (DD2.64), pcuPL (DD6.42)
POS: pcuAI (R57.1 VT1.3), pcuPL (DD6.5)
PWM0-10V: pcuOut (R138.2), pcuPL (DD6.84)
PWM0-20mA: pcuOut (R146.2), pcuPL (DD6.83)
PWM1.3: pcuCPU (DD2.73), pcuPL (DD6.35)
PWM1.4: pcuCPU (DD2.70), pcuPL (DD6.36)
PWM1.5: pcuCPU (DD2.69), pcuPL (DD6.37)
PWM1.6: pcuCPU (DD2.68), pcuPL (DD6.38)
R380: pcuAI (DA2.7 R52.1 VD7.1), pcuCPU (DD2.7)
~{RST}: pcuCPU (5 pins), pcuETH (U9.29)
R_SCR: pcuAI (DA3.7 R53.1 VD8.1), pcuCPU (DD2.9)
RELE1: pcuCPU (DD2.29), pcuPL (DD6.81)
RS1: pcuOut (R155.1 VT6.1), pcuPL (DD6.88)
RTS1: pcuCPU (DD2.66), pcuPL (DD6.40)
RXD: pcuOut (DA23.4 R164.2), pcuPL (DD6.27)
RXD0: pcuCPU (DD2.99 H12.2), pcuPL (DD6.21)
RXD1: pcuCPU (DD2.74), pcuPL (DD6.34)
RXD3: pcuTC (DA7.4 R84.2), pcuCPU (DD2.47)
SCK0: pcuCPU (DD2.62), pcuPL (DD6.48)
SCR0: pcuOut (R170.1 VT10.1), pcuPL (DD6.3)
SCR1: pcuOut (R175.2 VT12.1), pcuPL (DD6.6)
SCR2: pcuOut (R177.2 VT13.1), pcuPL (DD6.7)
SCR_CUR: pcuAI (C16.1 DA1.7), pcuOut (DA27.3)
SSEL0: pcuCPU (DD2.63), pcuPL (DD6.47)
~{T}/R: pcuOut (R162.1 VT8.1), pcuPL (DD6.28)
TXD: pcuOut (DA22.2), pcuPL (DD6.26)
TXD0: pcuCPU (DD2.98 H12.3), pcuPL (DD6.20)
TXD1: pcuCPU (DD2.75), pcuPL (DD6.33)
TXD3: pcuTC (DA6.2), pcuCPU (DD2.46)
V0/MCOA1: pcuCPU (DD2.39), pcuPL (DD6.67)
V0_PWM: pcuOut (R156.2), pcuPL (DD6.1)